# Altium schematic sheet Converter_Voltage to Current.SchDoc
size 162 x 101 mm
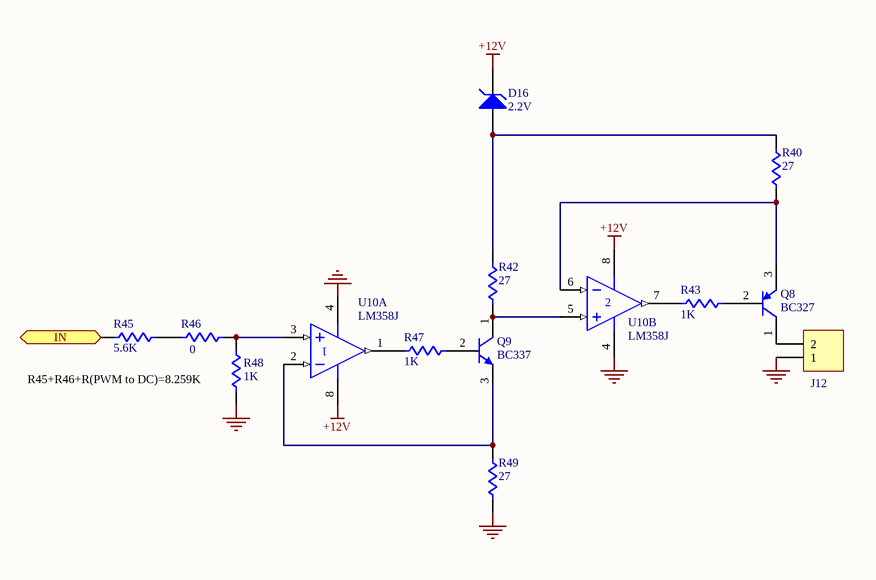
[diagram p0: Converter_Voltage to Current.SchDoc]

## Parts
D16  value 2.2V  [DIODE-0.4]  (hidden comment: D Zener)
J12  Header 2  [Fonics_2PIN_1]  (value not drawn)
Q8  Device: BC327  [TO92C]  (hidden comment: PNP)
Q9  value BC337  [TO92C]  (hidden comment: NPN)
R40  value 27  [AXIAL-0.4]  (hidden comment: Res1)
R42  value 27  [AXIAL-0.4]  (hidden comment: Res1)
R43  value 1K  [AXIAL-0.4]  (hidden comment: Res1)
R45  value 5.6K  [AXIAL-0.4]  (hidden comment: Res1)
R46  value 0  [AXIAL-0.4]  (hidden comment: Res1)
R47  value 1K  [AXIAL-0.4]  (hidden comment: Res1)
R48  value 1K  [AXIAL-0.4]  (hidden comment: Res1)
R49  value 27  [AXIAL-0.4]  (hidden comment: Res1)
U10  LM358J  [693-02]  (parts A,B of 2)

## Ports
IN (in)

## Nets
+12V: D16.2(K) U10.8(V+)
GND: J12.1 R48.2 R49.1 U10.4(V-)
IN: R45.1 ; port IN
NetD16_1: D16.1(A) R40.2 R42.2
NetJ12_2: J12.2 Q8.1(C)
NetQ8_2: Q8.2(B) R43.2
NetQ8_3: Q8.3(E) R40.1 U10.6(IN-)
NetQ9_1: Q9.1(C) R42.1 U10.5(IN+)
NetQ9_2: Q9.2(B) R47.2
NetQ9_3: Q9.3(E) R49.2 U10.2(IN-)
NetR43_1: R43.1 U10.7(OUT)
NetR45_2: R45.2 R46.1
NetR46_2: R46.2 R48.1 U10.3(IN+)
NetR47_1: R47.1 U10.1(OUT)

## Notes on the sheet
- R45+R46+R(PWM to DC)=8.259K

## Library data of the parts
D16 = D Zener: Zener Diode; Manufacturer: Generic Components; Class I: Discrete; Class II: Diode - Zener; Published: 8-Jun-2000; Revision: July-2002: Re-released for DXP Platform.; Publisher: Altium Limited
J12 = Header 2: Header, 2-Pin; LatestRevisionDate: 17-Jul-2002; LatestRevisionNote: Re-released for DXP Platform.; Publisher: Altium Limited
Q8 = PNP: Silicon Bipolar Transistor; Package Reference: TO-92A
Q9 = NPN: NPN Bipolar Transistor; Manufacturer: Generic Components; Class I: Discrete; Class II: BJT - Low Power; Published: 8-Jun-2000; Revision: July-2002: Re-released for DXP Platform.; Publisher: Altium Limited
R40 R42 R43 R45-R49 = Res1: Resistor; Manufacturer: Generic Components; Class I: Passive; Published: 8-Jun-2000; Revision: July-2002: Re-released for DXP Platform.; Publisher: Altium Limited; Class II: Resistor
U10 = LM358J: Dual Low-Power Operational Amplifier; Published: 17-Jul-2002; LatestRevisionDate: 06-Jun-2005; LatestRevisionNote: Stylized 3D Model Added.; DatasheetVersion: 1988; PackageReference: 693-02; Publisher: Altium Limited; PackageDescription: DIP; 8 Leads; Row Spacing 7.62 mm; Pitch 2.54 mm; Code_JEDEC: MO-001-AN; ComponentLink1Description: Manufacturer Link; ComponentLink1URL: http://www.onsemi.com/site/products/parametrics/0,4446,251,00.html; ComponentLink2Description: Datasheet; ComponentLink2URL: http://www.onsemi.com/pub/Collateral/LM358-D.PDF